# EasyEDA Pro project car1.eprj, schematic Schematic3
Board Name: 接收端; Create Date: 2025-05-02; Page Name: P1; Project Name: car1; Schematic Name: Schematic3; Update Date: 2025-05-26; Company: 嘉立创EDA; Page Size: A4; Version: V1.0
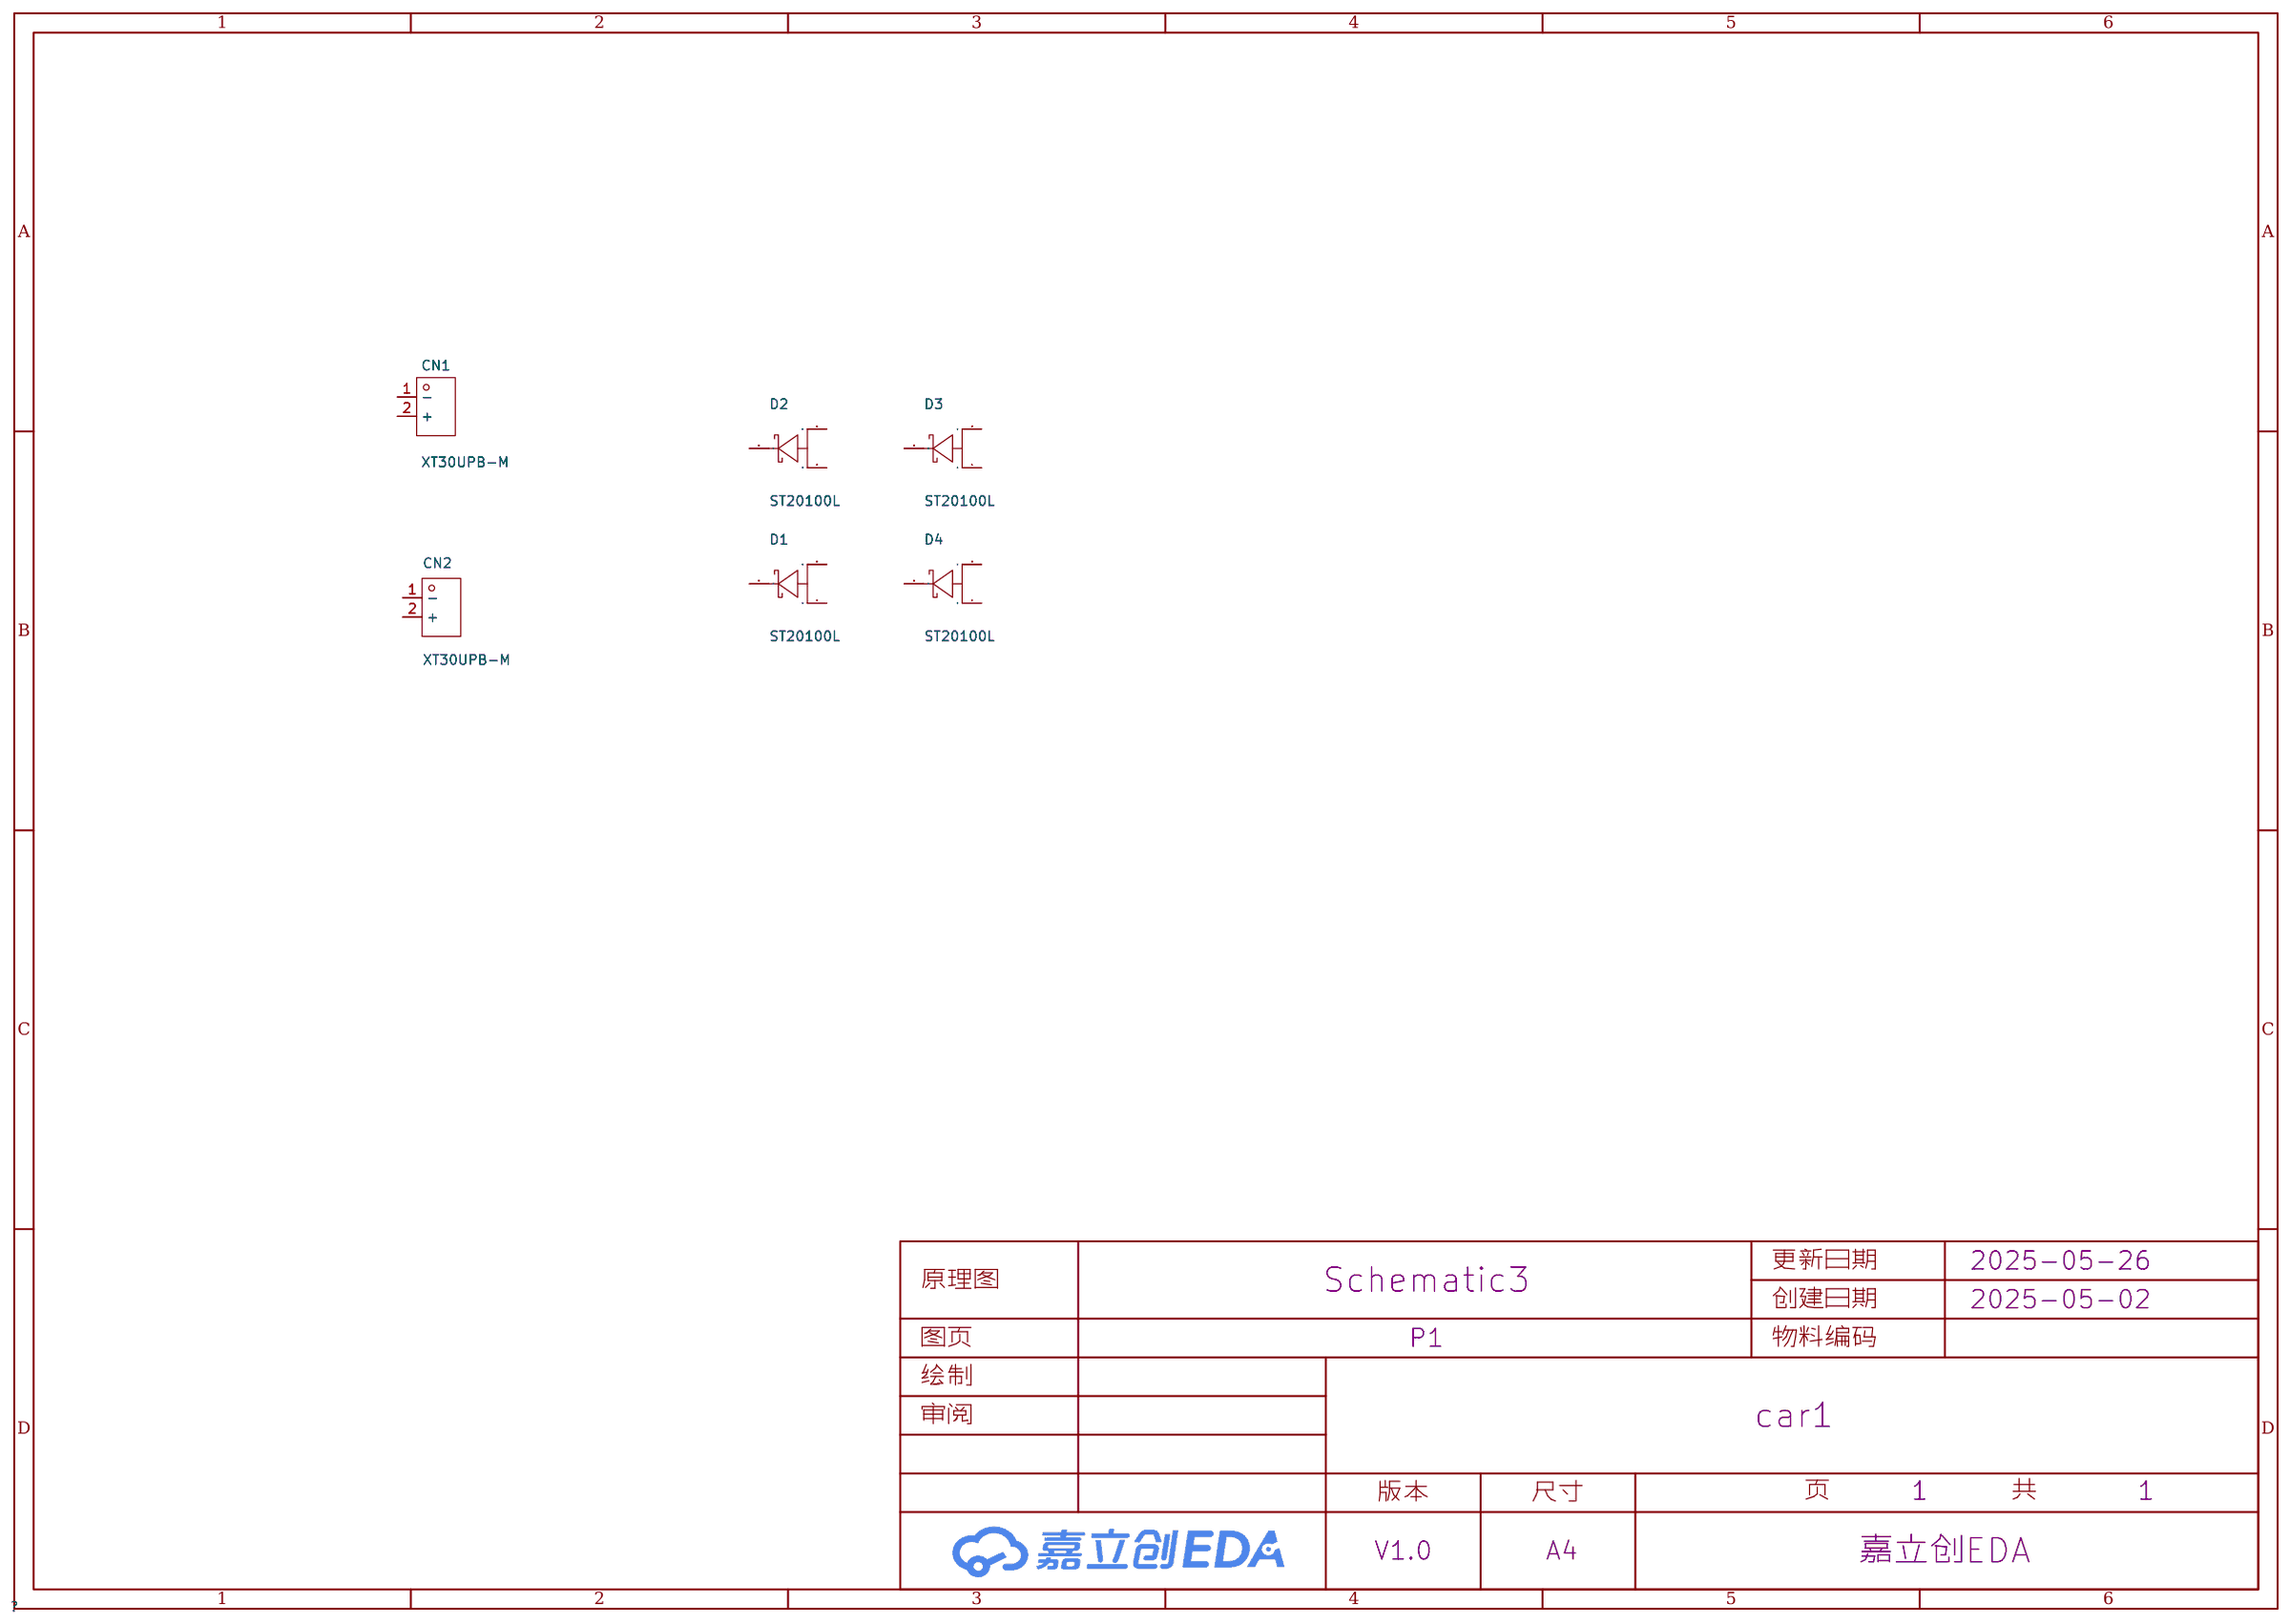
[diagram p10: schematic sheet]

## Parts
CN1  XT30UPB-M  [CONN-TH_XT30UPB-M]
CN2  XT30UPB-M  [CONN-TH_XT30UPB-M]
D1  ST20100L  [TO-277_3P-L5.7-W4.2-LS6.5-BR]
D2  ST20100L  [TO-277_3P-L5.7-W4.2-LS6.5-BR]
D3  ST20100L  [TO-277_3P-L5.7-W4.2-LS6.5-BR]
D4  ST20100L  [TO-277_3P-L5.7-W4.2-LS6.5-BR]

## Library data of the parts
CN1 CN2 = XT30UPB-M: Supplier Part: C428721; Manufacturer: AMASS(艾迈斯); JLCPCB Part Class: Extended Part; Datasheet: https://atta.szlcsc.com/upload/public/pdf/source/20190916/C428721_B0ECB8C5937139CEFE8736D2D3175B0E.pdf; Supplier: LCSC
D1-D4 = ST20100L: 二极管配置:独立式;正向压降(Vf):650mV@20A;直流反向耐压(Vr):100V;整流电流:20A;; LCSC Part Name: 电压:100V 电流:20A; Supplier Part: C2693410; Manufacturer: CJ(江苏长电/长晶); Supplier Footprint: TO-277; JLCPCB Part Class: 扩展库; Datasheet: https://atta.szlcsc.com/upload/public/pdf/source/20210330/C2693410_9551F5ED840A67394421895091158B3C.pdf; Supplier: LCSC; Diode Configuration: 独立式; Voltage - Forward(Vf@If): 650mV@20A; Voltage - DC Reverse(Vr): 100V; Current - Rectified: 20A; Reverse Leakage Current (Ir): 30uA@100V

## Nets

Not connected (* = marked no-connect by the designer): CN1 1(-) 2(+); CN2 1(-) 2(+); D1 1(A) 2(K) 3(A); D2 1(A) 2(K) 3(A); D3 1(A) 2(K) 3(A); D4 1(A) 2(K) 3(A)
